# EAGLE schematic HW2_start (EAGLE 8.1.0)
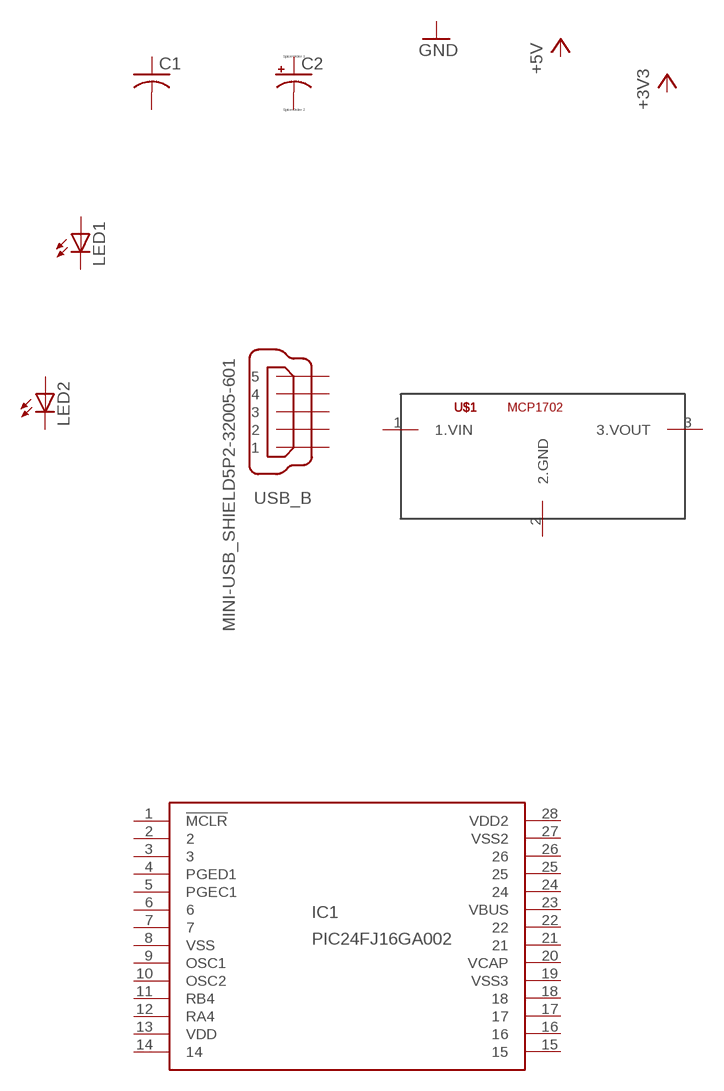
[diagram p0: schematic, sheet 1]

## Parts
C1  C-US050-025X075  [C050-025X075]
C2  CPOL-USB45181C  [B45181C]
IC1  PIC24FJ16GA002  [DIL28-3]
LED1  LED3MM  [LED3MM]
LED2  LED5MM  [LED5MM]
U$1  MCP1702  [TO92]
USB_B  MINI-USB_SHIELD5P2-32005-601  [32005-601]
Unconnected: C1.1 C1.2 C2.+ C2.- IC1.1(!MCLR) IC1.2 IC1.3 IC1.4(PGED1) IC1.5(PGEC1) IC1.6 IC1.7 IC1.9(OSC1) IC1.10(OSC2) IC1.11(RB4) IC1.12(RA4) IC1.14 IC1.15 IC1.16 IC1.17 IC1.18 IC1.19(VSS3) IC1.21 IC1.22 IC1.23(VBUS) IC1.24 IC1.25 IC1.26 LED1.A LED1.K(C) LED2.A LED2.K(C) U$1.1(1.VIN) U$1.2(2.GND) U$1.3(3.VOUT) USB_B.1 USB_B.2 USB_B.3 USB_B.4 USB_B.5 USB_B.M1(S1) USB_B.M2(S2)

## Power pins joined to a net without a drawn wire
VCAP: IC1.20(VCAP)
VDD: IC1.13(VDD)
VDD2: IC1.28(VDD2)
VSS: IC1.8(VSS)
VSS2: IC1.27(VSS2)

## Library data of the parts
C1 = ME433:C-US: CAPACITOR, American symbol
C2 = ME433:CPOL-US: POLARIZED CAPACITOR, American symbol
IC1 = ME433:PIC24FJ16GA002: PIC24FJ16GA002 edit this description Auto generated by make-symbol-device-package-bsdl.ulp Rev. 25 Source: PIC24FJ16GA002.bsd; MPN: PIC24FJ16GA002-I/SP; OC_FARNELL: 1816078; OC_NEWARK: 40M1427
LED1 LED2 = ME433:LED: LED OSRAM: - CHIPLED LG R971, LG N971, LY N971, LG Q971, LY Q971, LO R971, LY R971 LH N974, LH R974 LS Q976, LO Q976, LY Q976 LO Q996 - Hyper CHIPLED LW Q18S LB Q993, LB Q99A, LB R99A - SideLED LS A670, LO A670, LY A670, LG A670, LP A670 LB A673, LV A673, LT A673, LW A673 LH A674 LY A675 LS A676, LA A676, LO A676, LY A676, LW A676 LS A679, LY A679, LG A679 - Hyper Micro SIDELED® LS Y876, LA Y876, LO Y876, LY Y876 LT Y87S - SmartLED LW L88C, LW L88S LB L89C, LB L89S, LG L890 LS L89K, LO L89K, LY L89K LS L896, LA L896, LO L896, LY L896 - TOPLED LS T670, LO T670, LY T670, LG T670, LP T670 LSG T670, LSP T670, LSY T670, LOP T670, LYG T670 LG T671, LOG T671, LSG T671 LB T673, LV T673, LT T673, LW T673 LH T674 LS T676, LA T676, LO T676, LY T676, LB T676, LH T676, LSB T676, LW T676 LB T67C, LV T67C, LT T67C, LS T67K, LO T67K, LY T67K, LW E67C LS E67B, LA E67B, LO E67B, LY E67B, LB E67C, LV E67C, LT E67C LW T67C LS T679, LY T679, LG T679 LS T770, LO T770, LY T770, LG T770, LP T770 LB T773, LV T773, LT T773, LW T773 LH T774 LS E675, LA E675, LY E675, LS T675 LS T776, LA T776, LO T776, LY T776, LB T776 LHGB T686 LT T68C, LB T68C - Hyper Mini TOPLED® LB M676 - Mini TOPLED Santana® LG M470 LS M47K, LO M47K, LY M47K Source: http://www.osram.convergy.de LUXEON: - LUMILED® LXK2-PW12-R00, LXK2-PW12-S00, LXK2-PW14-U00, LXK2-PW14-V00 LXK2-PM12-R00, LXK2-PM12-S00, LXK2-PM14-U00 LXK2-PE12-Q00, LXK2-PE12-R00, LXK2-PE12-S00, LXK2-PE14-T00, LXK2-PE14-U00 LXK2-PB12-K00, LXK2-PB12-L00, LXK2-PB12-M00, LXK2-PB14-N00, LXK2-PB14-P00, LXK2-PB14-Q00 LXK2-PR12-L00, LXK2-PR12-M00, LXK2-PR14-Q00, LXK2-PR14-R00 LXK2-PD12-Q00, LXK2-PD12-R00, LXK2-PD12-S00 LXK2-PH12-R00, LXK2-PH12-S00 LXK2-PL12-P00, LXK2-PL12-Q00, LXK2-PL12-R00 Source: www.luxeon.com KINGBRIGHT: KA-3528ASYC Source: www.kingbright.com
U$1 = ME433:MCP1702
USB_B = con-cypressindustries:MINI-USB_SHIELD5P2-: MINI USB-B R/A DIP 5pol. Source: www.cypressindustries.com; OC_FARNELL: unknown; OC_NEWARK: unknown